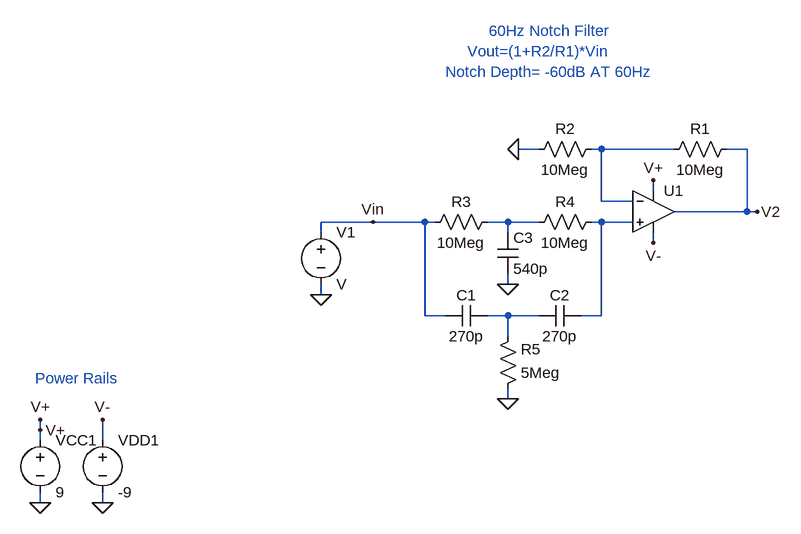
[diagram p0: schematic 60HzFilter.asc]
60HzFilter.asc, the LTspice schematic file:
Version 4
SHEET 1 892 680
WIRE 512 64 480 64
WIRE 608 64 592 64
WIRE 720 64 608 64
WIRE 832 64 800 64
WIRE 688 128 688 112
WIRE 608 144 608 64
WIRE 656 144 608 144
WIRE 832 160 832 64
WIRE 832 160 720 160
WIRE 848 160 832 160
WIRE 256 176 176 176
WIRE 336 176 256 176
WIRE 352 176 336 176
WIRE 464 176 432 176
WIRE 512 176 464 176
WIRE 608 176 592 176
WIRE 656 176 608 176
WIRE 176 192 176 176
WIRE 464 192 464 176
WIRE 688 208 688 192
WIRE 464 272 464 256
WIRE 176 288 176 272
WIRE 336 320 336 176
WIRE 368 320 336 320
WIRE 464 320 432 320
WIRE 512 320 464 320
WIRE 608 320 608 176
WIRE 608 320 576 320
WIRE 464 352 464 320
WIRE 464 448 464 432
WIRE -256 496 -256 480
WIRE -256 512 -256 496
WIRE -160 512 -160 480
WIRE -256 608 -256 592
WIRE -160 608 -160 592
FLAG 688 112 V+
FLAG 688 208 V-
FLAG 480 64 0
FLAG 464 448 0
FLAG 464 272 0
FLAG 256 176 Vin
FLAG 848 160 V2
FLAG -256 608 0
FLAG -256 480 V+
FLAG -160 608 0
FLAG -160 480 V-
FLAG -256 496 V+
FLAG 176 288 0
SYMBOL res 816 48 R90
WINDOW 0 0 56 VBottom 2
WINDOW 3 32 56 VTop 2
SYMATTR InstName R1
SYMATTR Value 10Meg
SYMBOL res 608 48 R90
WINDOW 0 0 56 VBottom 2
WINDOW 3 32 56 VTop 2
SYMATTR InstName R2
SYMATTR Value 10Meg
SYMBOL res 448 160 R90
WINDOW 0 0 56 VBottom 2
WINDOW 3 32 56 VTop 2
SYMATTR InstName R3
SYMATTR Value 10Meg
SYMBOL res 608 160 R90
WINDOW 0 0 56 VBottom 2
WINDOW 3 32 56 VTop 2
SYMATTR InstName R4
SYMATTR Value 10Meg
SYMBOL res 448 448 M180
WINDOW 0 36 76 Left 2
WINDOW 3 36 40 Left 2
SYMATTR InstName R5
SYMATTR Value 5Meg
SYMBOL cap 432 304 R90
WINDOW 0 0 32 VBottom 2
WINDOW 3 32 32 VTop 2
SYMATTR InstName C1
SYMATTR Value 270p
SYMBOL cap 576 304 R90
WINDOW 0 0 32 VBottom 2
WINDOW 3 32 32 VTop 2
SYMATTR InstName C2
SYMATTR Value 270p
SYMBOL cap 448 192 R0
SYMATTR InstName C3
SYMATTR Value 540p
SYMBOL Opamps/UniversalOpamp2 688 160 R0
SYMATTR InstName U1
SYMBOL voltage -256 496 R0
SYMATTR InstName VCC1
SYMATTR Value 9
SYMBOL voltage -160 496 R0
SYMATTR InstName VDD1
SYMATTR Value -9
SYMBOL voltage 176 176 R0
SYMATTR InstName V1
TEXT 528 -40 Bottom 2 ;60Hz Notch Filter\nVout=(1+R2/R1)*Vin     \nNotch Depth= -60dB AT 60Hz
TEXT -264 416 Left 2 ;Power Rails

The netlist it stands for:
* 60HzFilter.asc
R1 V2 N001 10Meg
R2 N001 0 10Meg
R3 N002 Vin 10Meg
R4 N003 N002 10Meg
R5 0 N004 5Meg
C1 N004 Vin 270p
C2 N003 N004 270p
C3 N002 0 540p
XU1 N003 N001 V+ V- V2 level.2 Avol=1Meg GBW=10Meg Slew=10Meg ilimit=25m rail=0 Vos=0 phimargin=45 en=0 enk=0 in=0 ink=0 Rin=500Meg  ; pins IN+ IN- V+ V- OUT
VCC1 V+ 0 9
VDD1 V- 0 -9
V1 Vin 0 V
* 60Hz Notch Filter
* Vout=(1+R2/R1)*Vin
* Notch Depth= -60dB AT 60Hz
* Power Rails
.lib UniversalOpamps2.sub
.backanno
.end